# Altium schematic sheet PLL.SchDoc: PLL
size B; DocumentNumber: 12; SheetNumber: 12; SheetTotal: 46
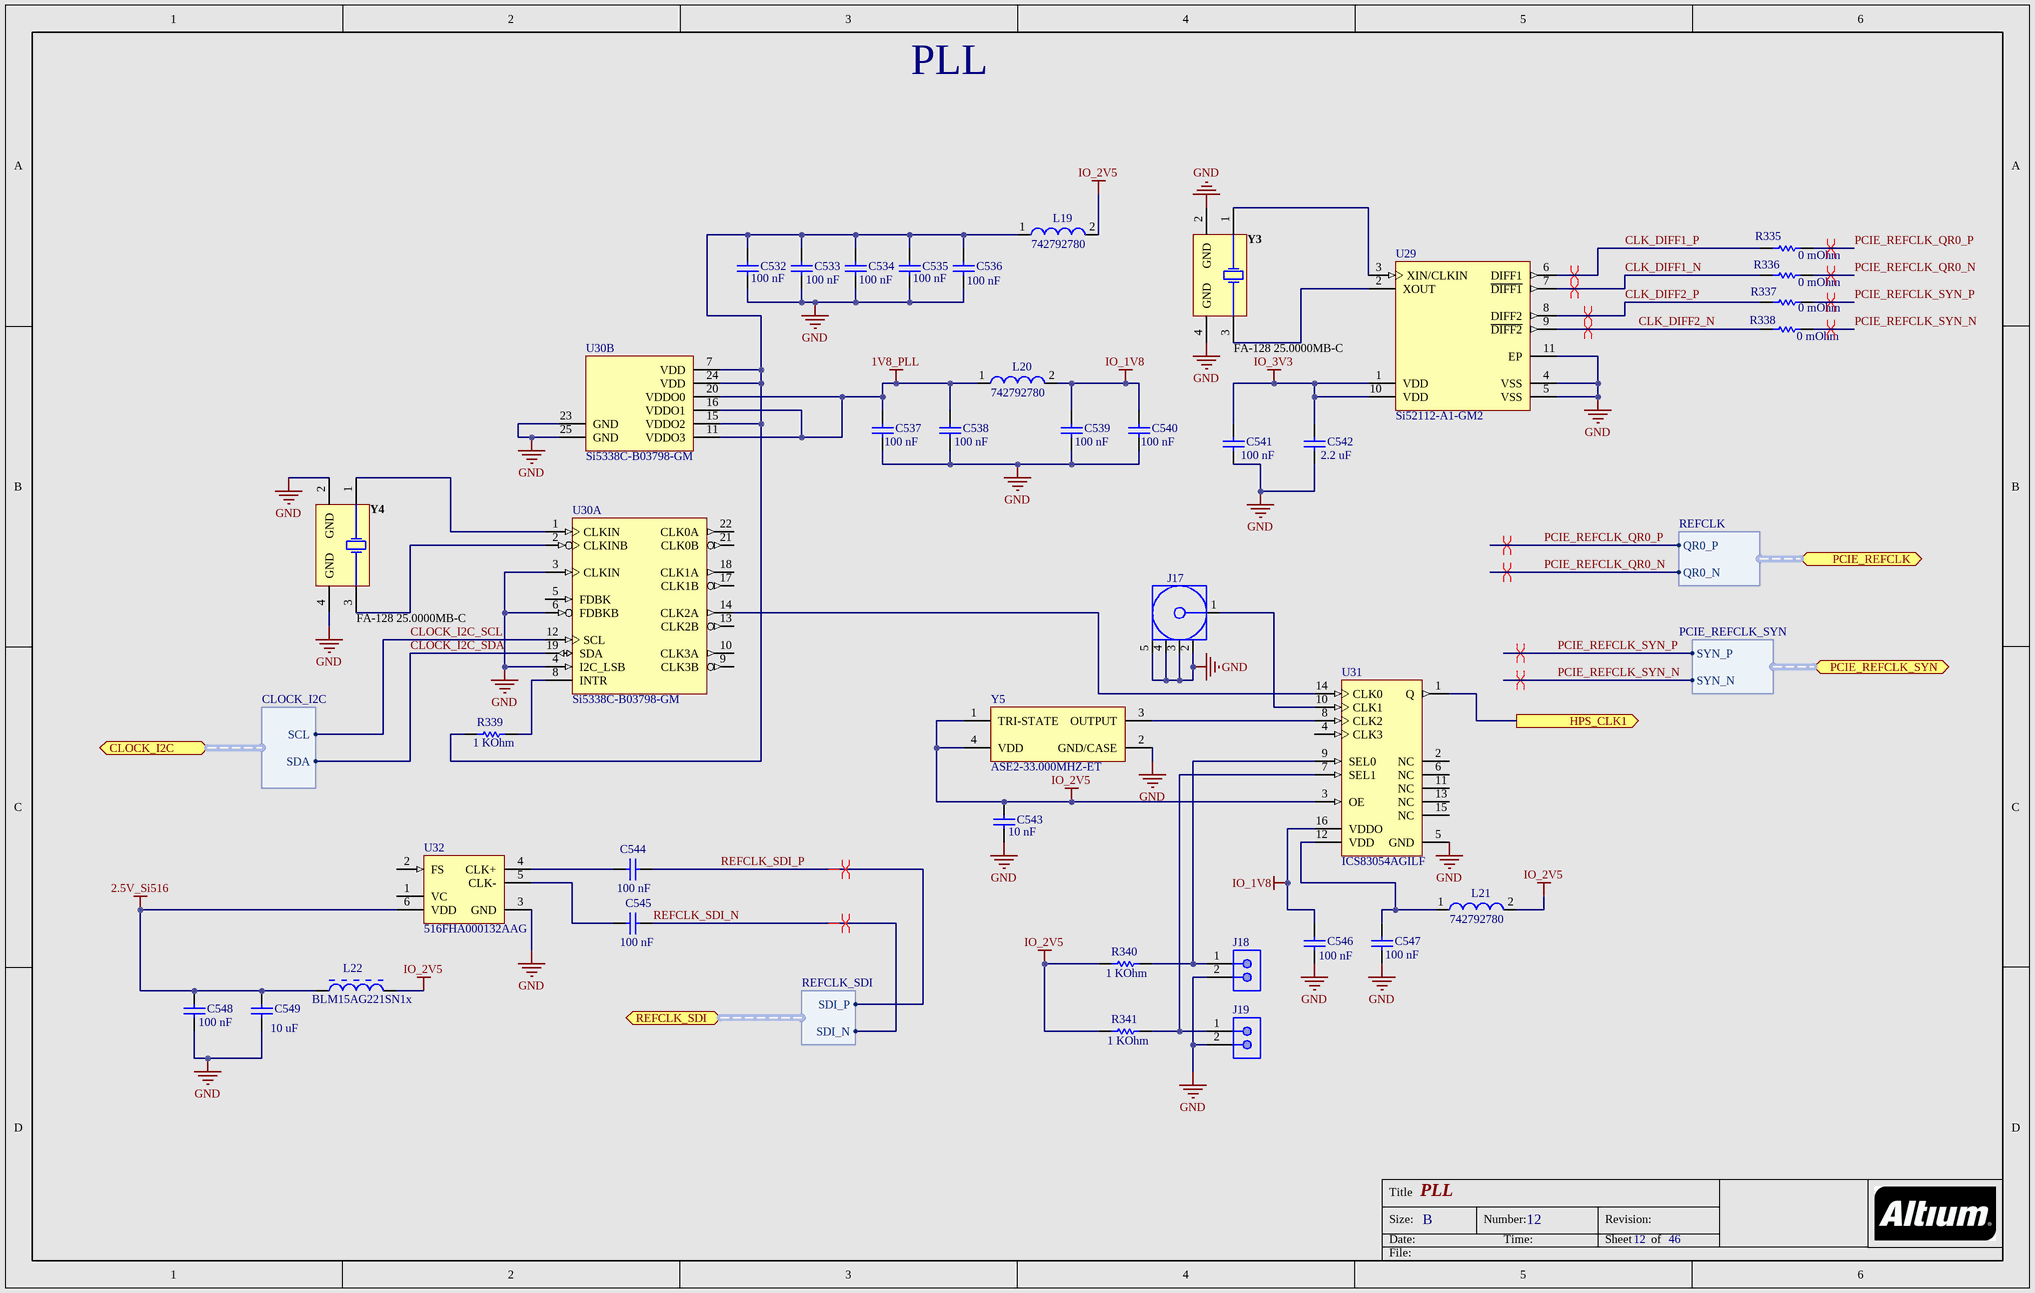
[diagram p0: PLL.SchDoc]

## Parts
C532  Capacitance: 100 nF  [CAPC1005X55X10LL05]  (hidden comment: C1005X7R1E104M)
C533  Capacitance: 100 nF  [CAPC1005X55X10LL05]  (hidden comment: C1005X7R1E104M)
C534  Capacitance: 100 nF  [CAPC1005X55X10LL05]  (hidden comment: C1005X7R1E104M)
C535  Capacitance: 100 nF  [CAPC1005X55X10LL05]  (hidden comment: C1005X7R1E104M)
C536  Capacitance: 100 nF  [CAPC1005X55X10LL05]  (hidden comment: C1005X7R1E104M)
C537  Capacitance: 100 nF  [CAPC1005X55X10LL05]  (hidden comment: C1005X7R1E104M)
C538  Capacitance: 100 nF  [CAPC1005X55X10LL05]  (hidden comment: C1005X7R1E104M)
C539  Capacitance: 100 nF  [CAPC1005X55X10LL05]  (hidden comment: C1005X7R1E104M)
C540  Capacitance: 100 nF  [CAPC1005X55X10LL05]  (hidden comment: C1005X7R1E104M)
C541  Capacitance: 100 nF  [CAPC1005X55X10LL05]  (hidden comment: C1005X7R1E104M)
C542  Capacitance: 2.2 uF  [CAPC1608X90X35ML10T15]  (hidden comment: GRM188R61A225KE34x)
C543  Capacitance: 10 nF  [CAPC1005X55X25ML05T10]  (hidden comment: GRM155R71H103KA88D)
C544  Capacitance: 100 nF  [CAPC1005X55X10LL05]  (hidden comment: C1005X7R1E104M)
C545  Capacitance: 100 nF  [CAPC1005X55X10LL05]  (hidden comment: C1005X7R1E104M)
C546  Capacitance: 100 nF  [CAPC1005X55X10LL05]  (hidden comment: C1005X7R1E104M)
C547  Capacitance: 100 nF  [CAPC1005X55X10LL05]  (hidden comment: C1005X7R1E104M)
C548  Capacitance: 100 nF  [CAPC1005X55X10LL05]  (hidden comment: C1005X7R1E104M)
C549  Capacitance: 10 uF  [CAPC2013X100X20NL20]  (hidden comment: C2012X5R1C106K085AC)
J17  LTI-SASF54GT  [LHT-LTI-SASF54GT_V]  (value not drawn)
J18  613 002 111 21  [WE-61300211121_V]  (value not drawn)
J19  613 002 111 21  [WE-61300211121_V]  (value not drawn)
L19  742792780  [SMD-0402]
L20  742792780  [SMD-0402]
L21  742792780  [SMD-0402]
L22  BLM15AG221SN1x  [MURA-BLM15AG221SN1x_V]
R335  Resistance: 0 mOhm  [RESC1005X40X25ML05T05]  (hidden comment: ERJ-2GE0R00X)
R336  Resistance: 0 mOhm  [RESC1005X40X25ML05T05]  (hidden comment: ERJ-2GE0R00X)
R337  Resistance: 0 mOhm  [RESC1005X40X25ML05T05]  (hidden comment: ERJ-2GE0R00X)
R338  Resistance: 0 mOhm  [RESC1005X40X25ML05T05]  (hidden comment: ERJ-2GE0R00X)
R339  Resistance: 1 KOhm  [RESC1005X40X25LL05T05]  (hidden comment: ERJ-2RKF1001X)
R340  Resistance: 1 KOhm  [RESC1005X40X25LL05T05]  (hidden comment: ERJ-2RKF1001X)
R341  Resistance: 1 KOhm  [RESC1005X40X25LL05T05]  (hidden comment: ERJ-2RKF1001X)
U29  Si52112-A1-GM2  [SLAB-TDFN-10_L]
U30  Si5338C-B03798-GM  [SLAB-QFN-24-2550x2550TP_V]  (parts A,B of 2)
U31  ICS83054AGILF  [IDT-TSSOP-16_M]
U32  516FHA000132AAG  [SLAB-DFN-6-5000X7000DE_A_V]
Y3  FA-128 25.0000MB-C  [EPSON-FA-128_V]
Y4  FA-128 25.0000MB-C  [EPSON-FA-128_V]
Y5  ASE2-33.000MHZ-ET  [ABRA-ASE2_V]

## Ports
CLOCK_I2C (harness CLOCK_I2C), HPS_CLK1 (out), PCIE_REFCLK (harness REFCLK), PCIE_REFCLK_SYN (harness PCIE_REFCLK_SYN), REFCLK_SDI (harness REFCLK_SDI)

## Harnesses
REFCLK: QR0_P, QR0_N
PCIE_REFCLK_SYN: SYN_N, SYN_P
REFCLK_SDI: SDI_P, SDI_N
CLOCK_I2C: SCL, SDA

## Nets
1V8_PLL: C537.2 C538.2 L20.1 U30.11(VDDO3) U30.16(VDDO1) U30.20(VDDO0)
2.5V_Si516: C548.2 C549.2 L22.1 U32.6(VDD)
GND: C532.1 C533.1 C534.1 C535.1 C536.1 C537.1 C538.1 C539.1 C540.1 C541.1 C542.1 C543.1 C546.1 C547.1 C548.1 C549.1 J17.2 J17.3 J17.4 J17.5 J18.2 J19.2 U29.4(VSS) U29.5(VSS) U29.11(EP) U30.3(CLKIN) U30.4(I2C_LSB) U30.6(FDBKB) U30.23(GND) U30.25(GND) U31.5(GND) U32.3(GND) Y3.2(GND) Y3.4(GND) Y4.2(GND) Y4.4(GND) Y5.2(GND/CASE)
IO_1V8: C539.2 C540.2 C546.2 L20.2 U31.16(VDDO)
IO_2V5: C543.2 L19.2 L21.2 L22.2 R340.1 R341.1 U31.3(OE) Y5.1(TRI-STATE) Y5.4(VDD)
IO_3V3: C541.2 C542.2 U29.1(VDD) U29.10(VDD)
CLK_DIFF1_N: R336.1 U29.7(~{DIFF1})
CLK_DIFF1_P: R335.1 U29.6(DIFF1)
CLK_DIFF2_N: R338.1 U29.9(~{DIFF2})
CLK_DIFF2_P: R337.1 U29.8(DIFF2)
CLOCK_I2C_SCL: U30.12(SCL) ; port CLOCK_I2C.SCL
CLOCK_I2C_SDA: U30.19(SDA) ; port CLOCK_I2C.SDA
HPS_CLK1: U31.1(Q) ; port HPS_CLK1
PCIE_REFCLK_QR0_N: R336.2 ; port PCIE_REFCLK.QR0_N
PCIE_REFCLK_QR0_P: R335.2 ; port PCIE_REFCLK.QR0_P
PCIE_REFCLK_SYN_N: R338.2 ; port PCIE_REFCLK_SYN.SYN_N
PCIE_REFCLK_SYN_P: R337.2 ; port PCIE_REFCLK_SYN.SYN_P
REFCLK_SDI_N: C545.1 ; port REFCLK_SDI.SDI_N
REFCLK_SDI_P: C544.1 ; port REFCLK_SDI.SDI_P
NetC532_2: C532.2 C533.2 C534.2 C535.2 C536.2 L19.1 R339.1 U30.7(VDD) U30.15(VDDO2) U30.24(VDD)
NetC544_2: C544.2 U32.4(CLK+)
NetC545_2: C545.2 U32.5(CLK-)
NetC547_2: C547.2 L21.1 U31.12(VDD)
NetJ17_1: J17.1 U31.10(CLK1)
NetJ18_1: J18.1 R340.2 U31.9(SEL0)
NetJ19_1: J19.1 R341.2 U31.7(SEL1)
NetR339_2: R339.2 U30.8(INTR)
NetU29_2: U29.2(XOUT) Y3.3(X2)
NetU29_3: U29.3(XIN/CLKIN) Y3.1(X1)
NetU30_1: U30.1(CLKIN) Y4.1(X1)
NetU30_2: U30.2(CLKINB) Y4.3(X2)
NetU30_14: U30.14(CLK2A) U31.14(CLK0)
NetU31_8: U31.8(CLK2) Y5.3(OUTPUT)

Not connected (* = marked no-connect by the designer): U30 5(FDBK) 9(CLK3B) 10(CLK3A) 13(CLK2B) 17(CLK1B) 18(CLK1A) 21(CLK0B) 22(CLK0A); U31 2(NC) 4(CLK3) 6(NC) 11(NC) 13(NC) 15(NC); U32 1(VC) 2(FS)

## Layout directives
differential pair: CLK_DIFF1_N, CLK_DIFF1_P, CLK_DIFF2_N, CLK_DIFF2_P, PCIE_REFCLK_QR0_N, PCIE_REFCLK_QR0_P, PCIE_REFCLK_SYN_N, PCIE_REFCLK_SYN_P, REFCLK_SDI_N, REFCLK_SDI_P

## Notes on the sheet
- Title
- Size:
- Date:
- B
- Number:
- Time:
- Revision:
- Sheet
- of
- File:

## Library data of the parts
C532-C541 C544-C548 = CMP-1663-00009-2: Chip Capacitor, 0.1 uF, +/- 20%, 25 V, -55 to 125 degC, 0402 (1005 Metric), RoHS, Tape and Reel; Type (Capacitors): X7R; Voltage Rating: 25 V; Case\/Package: 0402; Tolerance: 20%; Mounting Technology: Surface Mount; Max Operating Temperature: 125 degC; ComponentLink2URL: http://www.farnell.com/datasheets/1571323.pdf; ComponentLink1URL: http://www.tdk.com/; RoHSCompliant: true; Packaging: Tape and Reel; ComponentLink2Description: Datasheet; Case Code (Imperial): 0402; DatasheetVersion: 09/2011; ComponentLink1Description: Manufacturer URL; PackageDescription: 2-Pin Surface Mount Device, Body 1 x 0.5 mm; PackageReference: 0402; Min Operating Temperature: -55 degC; Case Code (Metric): 1005; Height: 0.5 mm; Package Quantity: 10000; Width: 0.5 mm; Pins: 2; Voltage Rating (DC): 25 V; PartNumber: C1005X7R1E104M; Mount: Surface Mount; Length: 1 mm
C542 = CMP-1662-00016-2: Chip Capacitor, 2.2 uF, +/- 10%, 10 V, -55 to 85 degC, 0603 (1608 Metric), RoHS, Tape and Reel; Tolerance: 10%; Width: 0.031 inch; DatasheetVersion: 01/2013; Case/Package: 0603; Length: 0.063 inch; PartNumber: GRM188R61A225KE34x; Package Quantity: 10000; Case Code (Imperial): 0603; Packaging: Tape and Reel; PackageDescription: 2-Pin Surface Mount Device, Body 1.6 x 0.8 mm; Case Code (Metric): 1608; ComponentLink1Description: Manufacturer URL; Radiation Hardening: No; Mounting Technology: Surface Mount; Height: 0.8 mm; RoHSCompliant: True; ComponentLink2URL: https://datasheet.ciiva.com/134/grm188r61a225ke34-01-134206.pdf; ComponentLink2Description: Datasheet; Max Operating Temperature: 85 degC; Min Operating Temperature: -55 degC; ComponentLink1URL: http://www.murata.com/
C543 = CMP-2008-04637-4: Chip Capacitor, 10 nF, +/- 10%, 50 V, -55 to 125 degC, 0402 (1005 Metric), RoHS, Tape and Reel; Manufacturer: Basic Passives; Voltage Rating: 50 V; Case\/Package: 0402; Type (Capacitors): X7R; Mounting Technology: Surface Mount; Max Operating Temperature: 125 degC; Height: 0.5 mm; PackageDescription: 2-Pin Surface Mount Device, Body 1 x 0.5 mm; Case Code (Imperial): 0402; Tolerance: 10%; ComponentLink1URL: http://www.murata.com/; RoHSCompliant: true; Width: 0.5 mm; Package Quantity: 10000; Packaging: Tape and Reel; ComponentLink1Description: Manufacturer URL; Min Operating Temperature: -55 degC; PartNumber: GRM155R71H103KA88D; REACH SVHC: No SVHC; Case Code (Metric): 1005; Length: 1 mm; DatasheetVersion: 02/2016; Mount: Surface Mount; Radiation Hardening: No; Lead Pitch: 2mm; Voltage Rating (DC): 50 V; Pins: 2; ComponentLink2URL: http://search.murata.co.jp/Ceramy/image/img/A01X/G101/ENG/GRM155R71H103KA88-01.pdf; ComponentLink2Description: Datasheet; PackageReference: 0402
C549 = CMP-1663-00007-1: Chip Capacitor, 10 uF, +/- 10%, 16 V, -55 to 85 degC, 0805 (2012 Metric), RoHS, Tape and Reel; Type (Capacitors): X5R; Voltage Rating (DC): 16 V; Case\/Package: 0805; Tolerance: 10%; Mounting Technology: Surface Mount; Min Operating Temperature: -55 degC; Length: 2 mm; Case Code (Metric): 2012; PackageReference: 0805; Voltage Rating: 16 V; RoHSCompliant: true; ComponentLink1Description: Manufacturer URL; Width: 1.25 mm; ComponentLink1URL: http://www.tdk.com/; Max Operating Temperature: 85 degC; REACH SVHC: No SVHC; Mount: Surface Mount; ComponentLink2URL: https://product.tdk.com/info/en/catalog/datasheets/mlcc_commercial_general_en.pdf; ComponentLink2Description: Datasheet; Pins: 2; Packaging: Tape and Reel; Height: 0.85 mm; Package Quantity: 1; DatasheetVersion: 03/2015; Case Code (Imperial): 0805; PackageDescription: 2-Pin Surface Mount Device, Body 2 x 1.25 mm
J17 = CMP-1713-00001-1: SMA Connector, Pitch 2.54 mm, 1 Position, Height 9.5 mm, Tail Length 4 mm, RoHS; Manufacturer: Lighthorse Technologies Inc.; ComponentLink2Description: Datasheet; Mounting Technology: Through Hole; ComponentLink1Description: Manufacturer URL; PackageDescription: SMA Connector, Pitch 2.54 mm, 1 Position, Height 9.5 mm, Tail Length 4 mm; PartNumber: LTI-SASF54GT; PackageReference: LTI-SASF54GT; DatasheetVersion: Rev. May-99; ComponentLink2URL: http://rfconnector.com/sheets/SASF54GT.pdf; ComponentLink1URL: http://www.rfconnector.com
J18 J19 = CMP-1712-00002-1: Male Header, Pitch 2.54 mm, 1 x 2 Position, Height 8.54 mm, Tail Length 3 mm, -40 to 105 degC, RoHS, Bulk; Manufacturer: Wuerth Elektronik; DatasheetVersion: Rev. J; ComponentLink1Description: Manufacturer URL; ComponentLink2URL: http://katalog.we-online.de/em/datasheet/6130xx11121.pdf; PackageReference: 61300211121; ComponentLink2Description: Datasheet; Mounting Technology: Through Hole; PackageDescription: Male Header, Pitch 2.54 mm, 1 x 2 Position, Height 8.54 mm, Tail Length 3 mm; ComponentLink1URL: https://www.we-online.com/; PartNumber: 613 002 111 21
L19-L21 = CMP-0220-00137-1: SMD EMI Suppression Ferrite Bead WE-CBF, Z = 220 Ohm; Impedance: 220 Ohm; ComponentLink2URL: http://www.we-online.de/katalog/media/pdf/742792780.pdf; ComponentLink1URL: http://www.we-online.com; ComponentLink2Description: Datasheet; PackageDescription: Chip Inductor, 2-Leads, Body 1.0 x 0.5 mm; ComponentLink1Description: Manufacturer Link; PackageReference: SMD-0402; DatasheetVersion: ver 4, Jul-2009; PackageVersion: 2009
L22 = CMP-1662-00018-3: Chip Bead, 220 Ohm, +/- 25 %, 100 MHz, 300 mA, -55 to 125 degC, 0402 (1005 Metric), RoHS; Current Rating: 200 mA; Max Current Rating: 450 mA; Resistance: 220 Ohm; Tolerance: 25%; DatasheetVersion: 03/2011; ComponentLink2URL: https://datasheet.ciiva.com/11800/0900766b811b5866-11800858.pdf; PackageDescription: 2-Pin Surface Mount Device, Body 1 x 0.5 mm; Mounting Technology: Surface Mount; PartNumber: BLM15AG221SN1x; ComponentLink2Description: Datasheet; ComponentLink1Description: Manufacturer URL; ComponentLink1URL: http://www.murata.com/; Max Operating Temperature: 125 degC; Length: 1 mm; Width: 0.5 mm; REACH SVHC: No SVHC; Height: 0.5 mm; Case/Package: 0402; Min Operating Temperature: -55 degC; RoHSCompliant: True; Radiation Hardening: No; Package Quantity: 10000; Case Code (Imperial): 0402; Case Code (Metric): 1005
R335-R338 = CMP-2002-00429-3: Chip Resistor, 0 mOhm, +/- 5%, 100 mW, -55 to 155 degC, 0402 (1005 Metric), RoHS, Tape and Reel; Manufacturer: Basic Passives; Power Rating: 100 mW; Voltage Rating: 50 V; Case\/Package: 0402; Max Operating Temperature: 155 degC; Tolerance: 5%; PartNumber: ERJ-2GE0R00X; Case Code (Imperial): 0402; Package Quantity: 10000; Length: 1 mm; Mounting Technology: Surface Mount; ComponentLink1URL: http://www.panasonic.com/; Height: 0.35 mm; Width: 0.5 mm; Min Operating Temperature: -55 degC; Case Code (Metric): 1005; RoHSCompliant: true; REACH SVHC: Unknown; ComponentLink1Description: Manufacturer URL; Packaging: Tape and Reel; Mount: Surface Mount; PackageDescription: 2-Pin Surface Mount Device, Body 1 x 0.5 mm; PackageReference: 0402; ComponentLink2URL: http://industrial.panasonic.com/cdbs/www-data/pdf/RDA0000/AOA0000C84.pdf; DatasheetVersion: 03/2015; Radiation Hardening: No; Pins: 2; ComponentLink2Description: Datasheet
R339-R341 = CMP-2002-00606-3: Chip Resistor, 1 KOhm, +/- 1%, 100 mW, -55 to 155 degC, 0402 (1005 Metric), RoHS, Tape and Reel; Manufacturer: Basic Passives; Voltage Rating: 50 V; Power Rating: 100 mW; Case\/Package: 0402; PartNumber: ERJ-2RKF1001X; Width: 0.5 mm; ComponentLink1URL: http://www.panasonic.com/; Length: 1 mm; Min Operating Temperature: -55 degC; PackageDescription: 2-Pin Surface Mount Device, Body 1 x 0.5 mm; Case Code (Metric): 1005; Height: 0.35 mm; ComponentLink1Description: Manufacturer URL; Mounting Technology: Surface Mount; Tolerance: 1%; Packaging: Tape and Reel; Package Quantity: 10000; REACH SVHC: Yes; Max Operating Temperature: 155 degC; Mount: Surface Mount; RoHSCompliant: true; Case Code (Imperial): 0402; DatasheetVersion: 04/2015; Radiation Hardening: No; Pins: 2; ComponentLink2Description: Datasheet; PackageReference: 0402; ComponentLink2URL: http://industrial.panasonic.com/cdbs/www-data/pdf/RDA0000/AOA0000C86.pdf
U29 = CMP-1706-00007-1: PCI-Express Gen 1 Dual Output Clock Generator, 3.13 to 3.46 V, -40 to 85 degC, 10-Pin TDFN, RoHS, Tube; Manufacturer: Silicon Labs; PartNumber: Si52112-A1-GM2; ComponentLink1URL: http://www.silabs.com/; PackageReference: TDFN-10; DatasheetVersion: Rev. 1.2; PackageDescription: 10-Pin Small Outline Non-Lead, Body 3.00 x 3.00 mm, Pitch 0.50 mm; ComponentLink2URL: http://www.silabs.com/Support%20Documents/TechnicalDocs/Si52112-A1-A2.pdf; Code_IPC: J-STD-020; ComponentLink2Description: Datasheet; Mounting Technology: Surface Mount; Code_JEDEC: MO-229; ComponentLink1Description: Manufacturer URL
U30 = CMP-1706-00005-1: I2C-Programmable Any-Frequency, Any-Output Quad Clock Generator, 1.8 / 2.5 / 3.3 V, 0.16 to 200 MHz Output, -40 to 85 degC, 24-Pin QFN, RoHS; Manufacturer: Silicon Labs; ComponentLink2Description: Datasheet; Code_IPC: J-STD-020; DatasheetVersion: Rev. 1.6; PartNumber: Si5338C-B03798-GM; Mounting Technology: Surface Mount; PackageDescription: 24-Pin Quad Flat No-lead Package, Body 4 x 4 mm, Pitch 0.5 mm; ComponentLink1Description: Manufacturer URL; ComponentLink2URL: https://www.silabs.com/Support%20Documents/TechnicalDocs/Si5338.pdf; PackageReference: QFN-24; ComponentLink1URL: http://www.silabs.com/; PartId: 1
U31 = CMP-1699-00001-1: Single-Ended Multiplexer, 2.375 to 3.465 V, -40 to 85 degC, 16-Pin TSSOP, RoHS, Tube; Manufacturer: IDT; PackageReference: TSSOP-16; PackageDescription: 16-Pin Thin Shrink Small Outline Package, Body 5 x 4.4 mm, Pitch 0.65 mm; PartNumber: ICS83054AGILF; ComponentLink1URL: http://www.idt.com/; ComponentLink2URL: https://datasheet.ciiva.com/6676/idt-83054i-dst-20091106-6676576.pdf; Mounting Technology: Surface Mount; ComponentLink2Description: Datasheet; ComponentLink1Description: Manufacturer URL; DatasheetVersion: Rev. C
U32 = CMP-1706-00001-1: Dual Frequency Voltage-Controlled Crystal Oscillator (VCXO), LVDS, 2.5 V, 100 KHz to 250 MHz, -40 to 85 degC, 6-Pin DFN, RoHS, Tray; Manufacturer: Silicon Labs; ComponentLink2URL: http://www.silabs.com/Support%20Documents/TechnicalDocs/Si516.pdf; Mounting Technology: Surface Mount; PackageDescription: 6-Pin Small Outline No-lead, Body 5 x 7 mm, Pitch 2.54 mm; ComponentLink2Description: Datasheet; PartNumber: 516FHA000132AAG; PackageReference: DFN-6; ComponentLink1URL: http://www.silabs.com/; ComponentLink1Description: Manufacturer URL; DatasheetVersion: Rev. 1.0
Y3 Y4 = CMP-1695-00001-3: Range Crystal Unit, 25 MHz, -40 to 85 degC, 4-Pin SMD, RoHS, Tape and Reel; ComponentLink2Description: Datasheet; Mounting Technology: Surface Mount; PackageDescription: 4-Pin Surface Mount Device, Body 1.6 x 2 mm, Pitch 1.45 mm; ComponentLink1URL: https://www.eea.epson.com/; DatasheetVersion: Rev. Feb-15; ComponentLink2URL: https://support.epson.biz/td/api/doc_check.php?dl=brief_FA-128_en.pdf; ComponentLink1Description: Manufacturer URL; PartNumber: FA-128 25.0000MB-C
Y5 = CMP-1688-00001-1: CMOS Compatible SMD Crystal Oscillator, 33 MHz, 2.5 V, -20 to 70 degC, 4-Pin SMD, RoHS, Tape and Reel; Manufacturer: Abracon; Mounting Technology: Surface Mount; ComponentLink1Description: Manufacturer URL; PackageReference: ASE2; PartNumber: ASE2-33.000MHZ-ET; PackageDescription: 4-Pin Surface Mount Device, Body 3.2 x 2.5 mm, Pitch 2.1 mm; DatasheetVersion: Rev. Aug-14; ComponentLink2URL: http://www.abracon.com/Oscillators/ASE2series.pdf; ComponentLink2Description: Datasheet; ComponentLink1URL: http://www.abracon.com/